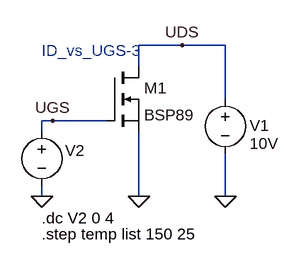
[diagram p0: schematic ID_vs_UGS-3.asc]
ID_vs_UGS-3.asc, the LTspice schematic file:
Version 4
SHEET 1 1292 680
WIRE -656 -160 -720 -160
WIRE -592 -160 -656 -160
WIRE -720 -128 -720 -160
WIRE -592 -80 -592 -160
WIRE -848 -48 -864 -48
WIRE -768 -48 -848 -48
WIRE -864 -32 -864 -48
WIRE -864 64 -864 48
WIRE -720 64 -720 -32
WIRE -592 64 -592 0
FLAG -592 64 0
FLAG -864 64 0
FLAG -720 64 0
FLAG -848 -48 UGS
FLAG -656 -160 UDS
SYMBOL voltage -592 -96 R0
WINDOW 123 0 0 Left 2
WINDOW 39 37 60 Left 2
WINDOW 0 36 55 Left 2
WINDOW 3 36 82 Left 2
SYMATTR InstName V1
SYMATTR Value 10V
SYMBOL voltage -864 -48 R0
WINDOW 123 0 0 Left 2
WINDOW 39 40 53 Left 2
WINDOW 3 -97 181 Left 2
WINDOW 0 35 44 Left 2
SYMATTR Value ""
SYMATTR InstName V2
SYMBOL nmos -768 -128 R0
SYMATTR InstName M1
SYMATTR Value BSP89
TEXT -864 96 Left 2 !.dc V2 0 4
TEXT -864 120 Left 2 !.step temp list 150 25
TEXT -864 -152 Left 2 ;ID_vs_UGS-3

The netlist it stands for:
* ID_vs_UGS-3.asc
V1 UDS 0 10V
V2 UGS 0
M1 UDS UGS 0 0 BSP89
.model NMOS NMOS
.model PMOS PMOS
.lib standard.mos
.dc V2 0 4
.step temp list 150 25
* ID_vs_UGS-3
.backanno
.end